# Altium schematic sheet Esquematico.SchDoc: Circuito Controlador LEDS
size A3; Date: 25/05/2023; CheckedBy: GAV; Author: MAG; Address1: MAG; Address2: GAV; Revision: 1; SheetNumber: 1; SheetTotal: 1
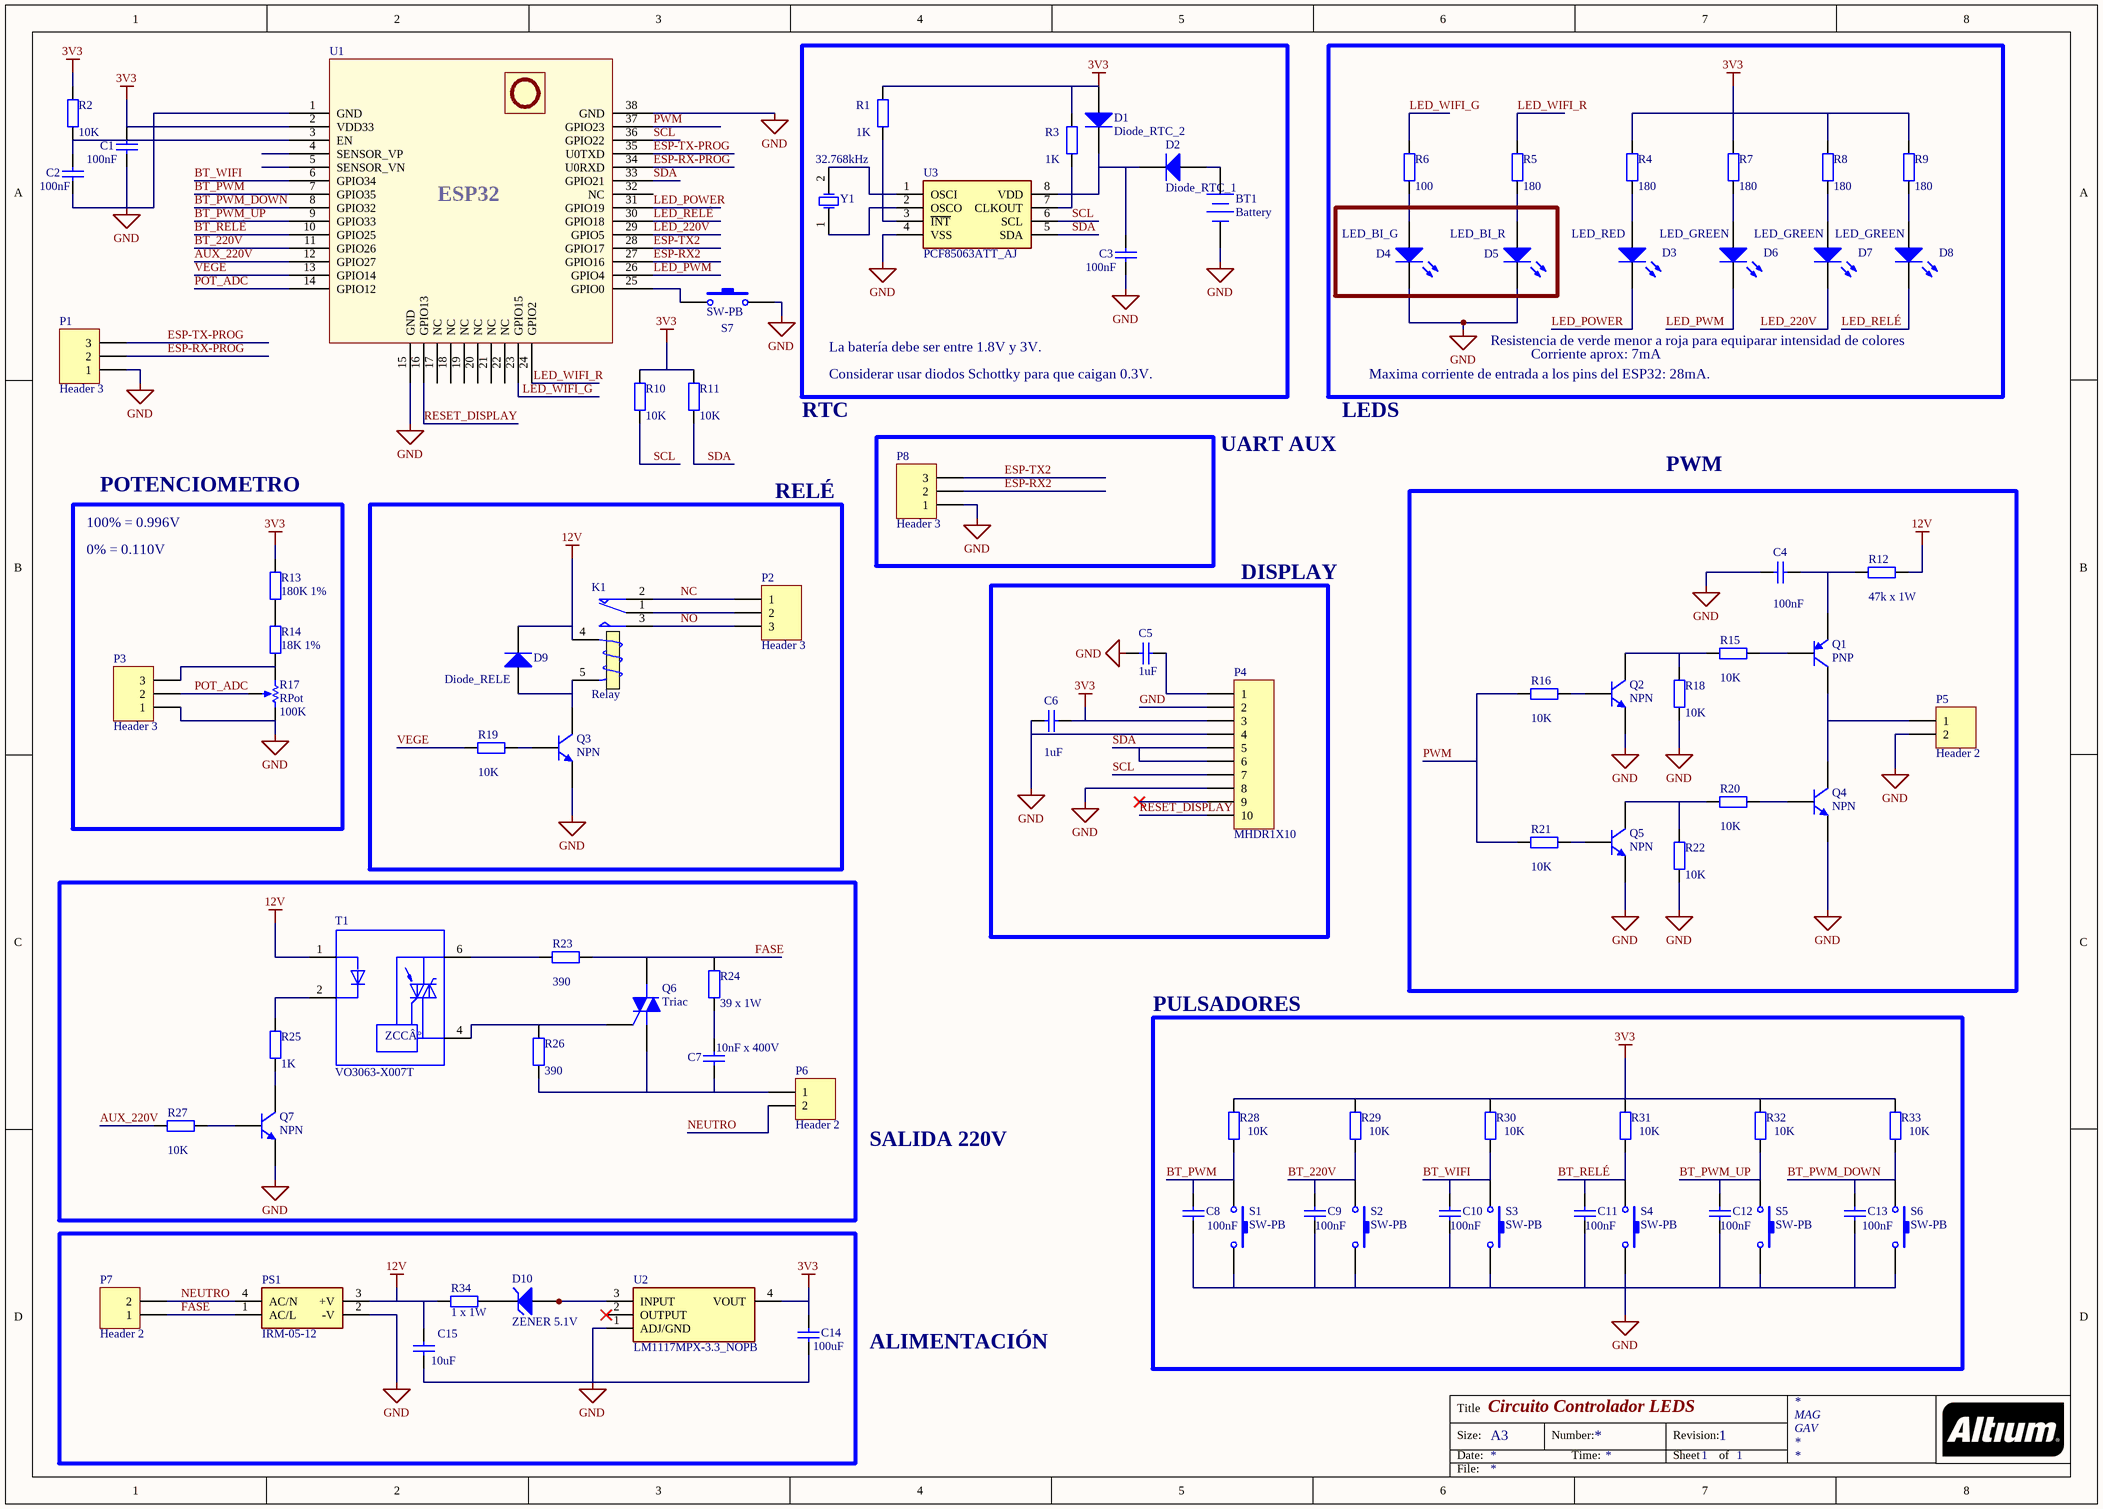
[diagram p0: Esquematico.SchDoc]

## Parts
BT1  Battery  [BAT-2]
C1  value 100nF  [RAD-0.3]  (hidden comment: Capacitor 100nF)
C2  value 100nF  [RAD-0.3]  (hidden comment: Capacitor 100nF)
C3  value 100nF  [RAD-0.3]  (hidden comment: Capacitor 100nF)
C4  value 100nF  [RAD-0.3]  (hidden comment: Capacitor 100nF)
C5  value 1uF  [RAD-0.3]  (hidden comment: Capacitor 1uF)
C6  value 1uF  [RAD-0.3]  (hidden comment: Capacitor 1uF)
C7  value 10nF x 400V  [RAD-0.3]  (hidden comment: Capacitor 10nF)
C8  value 100nF  [RAD-0.3]  (hidden comment: Capacitor 100nF)
C9  value 100nF  [RAD-0.3]  (hidden comment: Capacitor 100nF)
C10  value 100nF  [RAD-0.3]  (hidden comment: Capacitor 100nF)
C11  value 100nF  [RAD-0.3]  (hidden comment: Capacitor 100nF)
C12  value 100nF  [RAD-0.3]  (hidden comment: Capacitor 100nF)
C13  value 100nF  [RAD-0.3]  (hidden comment: Capacitor 100nF)
C14  value 100uF  [RAD-0.3]  (hidden comment: Capacitor 100uF)
C15  value 10uF  [RAD-0.3]  (hidden comment: Capacitor 10uF)
D1  Diode_RTC_2  [SMC]
D2  Diode_RTC_1  [SMC]
D3  LED_RED  [LED-0]
D4  LED_BI_G  [LED-0]
D5  LED_BI_R  [LED-0]
D6  LED_GREEN  [LED-0]
D7  LED_GREEN  [LED-0]
D8  LED_GREEN  [LED-0]
D9  Diode_RELE  [SMC]
D10  ZENER 5.1V  [DIODE-0.7]
K1  Relay  [MODULE5B]
P1  Header 3  [HDR1X3]
P2  Header 3  [HDR1X3]
P3  Header 3  [HDR1X3]
P4  MHDR1X10  [MHDR1X10]
P5  Header 2  [HDR1X2]
P6  Header 2  [HDR1X2]
P7  Header 2  [HDR1X2]
P8  Header 3  [HDR1X3]
PS1  IRM-05-12  [IRM0524]
Q1  PNP  [SOT-23B_L]
Q2  NPN  [TO-226-AA]
Q3  NPN  [TO-226-AA]
Q4  NPN  [TO-226-AA]
Q5  NPN  [TO-226-AA]
Q6  Triac  [369-03]
Q7  NPN  [TO-226-AA]
R1  value 1K  [AXIAL-0.4]  (hidden comment: Resistor 1k)
R2  value 10K  [AXIAL-0.4]  (hidden comment: Resistor 10k)
R3  value 1K  [AXIAL-0.4]  (hidden comment: Resistor 1k)
R4  value 180  [AXIAL-0.4]  (hidden comment: Resistor 100)
R5  value 180  [AXIAL-0.4]  (hidden comment: Resistor 50)
R6  value 100  [AXIAL-0.4]  (hidden comment: Resistor 100)
R7  value 180  [AXIAL-0.4]  (hidden comment: Resistor 100)
R8  value 180  [AXIAL-0.4]  (hidden comment: Resistor 100)
R9  value 180  [AXIAL-0.4]  (hidden comment: Resistor 100)
R10  value 10K  [AXIAL-0.4]  (hidden comment: Resistor 10k)
R11  value 10K  [AXIAL-0.4]  (hidden comment: Resistor 10k)
R12  value 47k x 1W  [AXIAL-0.4]  (hidden comment: Resistor 47k)
R13  value 180K 1%  [AXIAL-0.4]  (hidden comment: Resistor 180k)
R14  value 18K 1%  [AXIAL-0.4]  (hidden comment: Resistor 18k 1%)
R15  value 10K  [AXIAL-0.4]  (hidden comment: Resistor 10k)
R16  value 10K  [AXIAL-0.4]  (hidden comment: Resistor 10k)
R17  RPot  value 100K  [VR5]
R18  value 10K  [AXIAL-0.4]  (hidden comment: Resistor 10k)
R19  value 10K  [AXIAL-0.4]  (hidden comment: Resistor 10k)
R20  value 10K  [AXIAL-0.4]  (hidden comment: Resistor 10k)
R21  value 10K  [AXIAL-0.4]  (hidden comment: Resistor 10k)
R22  value 10K  [AXIAL-0.4]  (hidden comment: Resistor 10k)
R23  value 390  [AXIAL-0.4]  (hidden comment: Resistor 390)
R24  value 39 x 1W  [AXIAL-0.4]  (hidden comment: Resistor 39)
R25  value 1K  [AXIAL-0.4]  (hidden comment: Resistor 1k)
R26  value 390  [AXIAL-0.4]  (hidden comment: Resistor 390)
R27  value 10K  [AXIAL-0.4]  (hidden comment: Resistor 10k)
R28  value 10K  [AXIAL-0.4]  (hidden comment: Resistor 10k)
R29  value 10K  [AXIAL-0.4]  (hidden comment: Resistor 10k)
R30  value 10K  [AXIAL-0.4]  (hidden comment: Resistor 10k)
R31  value 10K  [AXIAL-0.4]  (hidden comment: Resistor 10k)
R32  value 10K  [AXIAL-0.4]  (hidden comment: Resistor 10k)
R33  value 10K  [AXIAL-0.4]  (hidden comment: Resistor 10k)
R34  value 1 x 1W  [AXIAL-0.4]  (hidden comment: Resistor 1)
S1  SW-PB  [SPST-2]
S2  SW-PB  [SPST-2]
S3  SW-PB  [SPST-2]
S4  SW-PB  [SPST-2]
S5  SW-PB  [SPST-2]
S6  SW-PB  [SPST-2]
S7  SW-PB  [SPST-2]
T1  VO3063-X007T  [SOIC254P1030X460-6N]
U1  ESP32-WROOM-UE32  (value not drawn)
U2  LM1117MPX-3.3_NOPB  [SOT230P700X180-4N]
U3  PCF85063ATT_AJ  [SOP65P490X110-8N]
Y1  32.768kHz  [R38]

## Blocks framed on the sheet
PWM: C4 P5 Q1 Q2 Q4 Q5 R12 R15 R16 R18 R20-R22
POTENCIOMETRO: P3 R13 R14 R17
RELÉ: D9 K1 P2 Q3 R19
DISPLAY: C5 C6 P4
PULSADORES: C8-C13 R28-R33 S1-S6

## Nets
3V3: C1.2 C6.1 C14.2 D1.1(A) P4.3 R1.2 R2.1 R3.2 R4.2 R7.2 R8.2 R9.2 R10.1 R11.1 R13.1 R28.2 R29.2 R30.2 R31.2 R32.2 R33.2 U1.2(VDD33) U2.4(VOUT)
12V: C15.2 D9.2(K) K1.4(T1) PS1.3(+V) R12.2 R34.1 T1.1(A)
GND: BT1.2(-) C1.1 C2.1 C3.1 C4.1 C5.2 C6.2 C8.1 C9.1 C10.1 C11.1 C12.1 C13.1 C14.1 C15.1 D4.2(K) D5.2(K) P1.1 P3.1 P4.2 P4.4 P4.8 P5.2 P8.1 PS1.2(-V) Q2.3(E) Q3.3(E) Q4.3(E) Q5.3(E) Q7.3(E) R17.2(BOT) R18.1 R22.1 S1.2 S2.2 S3.2 S4.2 S5.2 S6.2 S7.2 U1.1(GND) U1.15(GND) U1.38(GND) U2.1(ADJ/GND) U3.4(VSS)
AUX_220V: R27.2 U1.12(GPIO27)
BT_220V: C9.2 R29.1 S2.1 U1.11(GPIO26)
BT_PWM: C8.2 R28.1 S1.1 U1.7(GPIO35)
BT_PWM_DOWN: C13.2 R33.1 S6.1 U1.8(GPIO32)
BT_PWM_UP: C12.2 R32.1 S5.1 U1.9(GPIO33)
BT_RELÉ: C11.2 R31.1 S4.1 U1.10(GPIO25)
BT_WIFI: C10.2 R30.1 S3.1 U1.6(GPIO34)
ESP-RX2: P8.2 U1.27(GPIO16)
ESP-RX-PROG: P1.2 U1.34(U0RXD)
ESP-TX2: P8.3 U1.28(GPIO17)
ESP-TX-PROG: P1.3 U1.35(U0TXD)
FASE: P7.1 PS1.1(AC/L) Q6.2(M2) R23.1 R24.2
LED_220V: D7.2(K) U1.29(GPIO5)
LED_POWER: D3.2(K) U1.31(GPIO19)
LED_PWM: D6.2(K) U1.26(GPIO4)
LED_RELÉ: D8.2(K) U1.30(GPIO18)
LED_WIFI_G: R6.2 U1.23(GPIO15)
LED_WIFI_R: R5.2 U1.24(GPIO2)
NC: K1.2(NC) P2.1
NEUTRO: P6.2 P7.2 PS1.4(AC/N)
NO: K1.3(NO) P2.3
POT_ADC: P3.2 R17.3(TAP) U1.14(GPIO12)
PWM: R16.1 R21.1 U1.37(GPIO23)
RESET_DISPLAY: P4.10 U1.16(GPIO13)
SCL: P4.7 R10.2 U1.36(GPIO22) U3.6(SCL)
SDA: P4.5 P4.6 R11.2 U1.33(GPIO21) U3.5(SDA)
VEGE: R19.2 U1.13(GPIO14)
NetBT1_1: BT1.1(+) D2.1(A)
NetC2_2: C2.2 R2.2 U1.3(EN)
NetC3_2: C3.2 D1.2(K) D2.2(K) U3.8(VDD)
NetC4_2: C4.2 Q1.3(E) R12.1
NetC5_1: C5.1 P4.1
NetC7_1: C7.1 P6.1 Q6.1(M1) R26.2
NetC7_2: C7.2 R24.1
NetD3_1: D3.1(A) R4.1
NetD4_1: D4.1(A) R6.1
NetD5_1: D5.1(A) R5.1
NetD6_1: D6.1(A) R7.1
NetD7_1: D7.1(A) R8.1
NetD8_1: D8.1(A) R9.1
NetD9_1: D9.1(A) K1.5(T2) Q3.1(C)
NetD10_1: D10.1(A) U2.3(INPUT)
NetD10_2: D10.2(K) R34.2
NetK1_1: K1.1(COM) P2.2
NetP3_3: P3.3 R14.2 R17.1(TOP)
NetP5_1: P5.1 Q1.1(C) Q4.1(C)
NetQ1_2: Q1.2(B) R15.2
NetQ2_1: Q2.1(C) R15.1 R18.2
NetQ2_2: Q2.2(B) R16.2
NetQ3_2: Q3.2(B) R19.1
NetQ4_2: Q4.2(B) R20.2
NetQ5_1: Q5.1(C) R20.1 R22.2
NetQ5_2: Q5.2(B) R21.2
NetQ6_3: Q6.3(G) R26.1 T1.4(MT1)
NetQ7_1: Q7.1(C) R25.1
NetQ7_2: Q7.2(B) R27.1
NetR1_1: R1.1 U3.3(~{INT})
NetR3_1: R3.1 U3.7(CLKOUT)
NetR13_2: R13.2 R14.1
NetR23_2: R23.2 T1.6(MT2)
NetR25_2: R25.2 T1.2(C)
NetS7_1: S7.1 U1.25(GPIO0)
NetU3_1: U3.1(OSCI) Y1.2(OSC2)
NetU3_2: U3.2(OSCO) Y1.1(OSC1)

Not connected (* = marked no-connect by the designer): P4 9*; U1 4(SENSOR_VP) 5(SENSOR_VN) 17(NC) 18(NC) 19(NC) 20(NC) 21(NC) 22(NC) 32(NC); U2 2(OUTPUT)*

## Notes on the sheet
- (near U1) ESP32
- La batería debe ser entre 1.8V y 3V.
- Considerar usar diodos Schottky para que caigan 0.3V.
- Maxima corriente de entrada a los pins del ESP32: 28mA.
- Resistencia de verde menor a roja para equiparar intensidad de colores
- Corriente aprox: 7mA
- RTC
- UART AUX
- LEDS
- 100% = 0.996V
- 0% = 0.110V
- SALIDA 220V
- ALIMENTACIÓN
- Title
- Size:
- Date:
- A3
- Number:
- Time:
- Revision:
- Sheet
- of
- File:
- (in symbol VO3063-X007T) ZCCÂ°

## Library data of the parts
BT1 = Battery: Multicell Battery; Published: 24-Mar-1999; LatestRevisionDate: 17-Jul-2002; LatestRevisionNote: Re-released for DXP Platform.; PackageReference: BAT-2; Publisher: Altium Limited; PackageDescription: Battery; 2 Leads
C1-C15 = Cap: Capacitor; Published: 8-Jun-2000; LatestRevisionDate: 17-Jul-2002; LatestRevisionNote: Re-released for DXP Platform.; PackageReference: RAD-0.3; Publisher: Altium Limited; PackageDescription: Radial Cap, Thru-Hole; 2 Leads; 0.3 in Pin Spacing
D1 D2 D9 = Diode: Default Diode; Published: 8-Jun-2000; LatestRevisionDate: 17-Jul-2002; LatestRevisionNote: Re-released for DXP Platform.; PackageVersion: Sep-1996; PackageReference: SMC; Publisher: Altium Limited; PackageDescription: DO-214-AB/SMC; 2 C-Bend Leads; Body 7.9 x 5.9 mm, inc. leads (LxW); Code_JEDEC: DO-214-AB
D3-D8 = LED0: Typical INFRARED GaAs LED; Published: 8-Jun-2000; LatestRevisionDate: 08-Jul-2005; LatestRevisionNote: Mech Layer 1 removed.; PackageReference: LED-0; Publisher: Altium Limited; PackageDescription: LED; 2 Leads
D10 = D Zener: Zener Diode; Published: 8-Jun-2000; LatestRevisionDate: 17-Jul-2002; LatestRevisionNote: Re-released for DXP Platform.; PackageReference: DIODE-0.7; Publisher: Altium Limited; PackageDescription: Diode, Thru-Hole; 2 Leads; 0.7 in Pin Spacing
K1 = Relay: SPDT Relay; Published: 8-Jun-2000; LatestRevisionDate: 17-Jul-2002; LatestRevisionNote: Re-released for DXP Platform.; PackageReference: MODULE5B; Publisher: Altium Limited
P1-P3 P8 = Header 3: Header, 3-Pin; LatestRevisionDate: 17-Jul-2002; LatestRevisionNote: Re-released for DXP Platform.; Publisher: Altium Limited
P4 = MHDR1X10: Header, 10-Pin; LatestRevisionDate: 17-Jul-2002; LatestRevisionNote: Re-released for DXP Platform.; Publisher: Altium Limited
P5-P7 = Header 2: Header, 2-Pin; LatestRevisionDate: 17-Jul-2002; LatestRevisionNote: Re-released for DXP Platform.; Publisher: Altium Limited
PS1 = IRM-05-24: Power Supply; Manufacturer_Name: Mean Well; Datasheet Link: https://www.farnell.com/datasheets/2547884.pdf; Height: 21.5mm; Manufacturer_Part_Number: IRM-05-24; Mouser Part Number: 709-IRM05-24; Mouser Price/Stock: https://www.mouser.co.uk/ProductDetail/MEAN-WELL/IRM-05-24?qs=WkdRfq4wf1PSjoBZExbP%252Bg%3D%3D; Arrow Part Number: IRM-05-24; Arrow Price/Stock: https://www.arrow.com/en/products/irm-05-24/mean-well-enterprises?region=nac
Q1 = PNP: PNP Bipolar Transistor; Published: 8-Jun-2000; LatestRevisionDate: 29-May-2009; LatestRevisionNote: IPC-7351 Footprint Added.; PackageVersion: Aug-1999; PackageReference: SOT-23B; Publisher: Altium Limited; PackageDescription: 3-Pin SOT-23 Package 0.95 mm Pitch, 2.4 mm Lead Span
Q2-Q5 Q7 = NPN: NPN Bipolar Transistor; Published: 8-Jun-2000; LatestRevisionDate: 17-Jul-2002; LatestRevisionNote: Re-released for DXP Platform.; PackageReference: TO-226-AA; Publisher: Altium Limited; PackageDescription: TO, Flat Index; 3 In-Line, Axial Leads; Body Dia. 4.8mm; Leads 0.55 x 0.51 mm (max); Code_JEDEC: TO-226-AA
Q6 = Triac: Silicon Bidirectional Triode Thyristor; Note: Pin 2 is electrically connected to Pin 4 (TAB); Published: 29-Sep-2000; LatestRevisionDate: 17-Jul-2002; LatestRevisionNote: Re-released for DXP Platform.; DatasheetVersion: 1999; PackageReference: 369-03; Publisher: Altium Limited; PackageDescription: TO, Thru-Hole, Vertical, Heatsink Mounted; 3 In-Line Leads; Pitch 2.28 mm; ComponentLink1Description: Manufacturer Link; ComponentLink1URL: http://www.motorola.com/
R1-R16 R18-R34 = Res2: Resistor; Published: 8-Jun-2000; LatestRevisionDate: 17-Jul-2002; LatestRevisionNote: Re-released for DXP Platform.; PackageReference: AXIAL-0.4; Publisher: Altium Limited; PackageDescription: Axial Device, Thru-Hole; 2 Leads; 0.4 in Pin Spacing
R17 = RPot: Potentiometer; Sim Note: Enter the Resistance value and the set point into parameter fields.; Set Position: 0.5; Published: 8-Jun-2000; LatestRevisionDate: 17-Jul-2002; LatestRevisionNote: Re-released for DXP Platform.; PackageReference: VR5; Publisher: Altium Limited; PackageDescription: Variable Resistor, Thru-Hole; 3 Leads
S1-S7 = SW-PB: Switch; Published: 24-Mar-1999; LatestRevisionDate: 17-Jul-2002; LatestRevisionNote: Re-released for DXP Platform.; PackageReference: SPST-2; Publisher: Altium Limited; PackageDescription: Switch; 2 Leads
T1 = VO3063-X007T: Phototriac, Zero Crossing, 1.5 kV/Î¼s dV/dt, 600 V; Package: None; Price: None; Value: *; MP: VO3063-X007T; Availability: Unavailable
U1 = Component_1
U2 = LM1117MPX-3.3_NOPB: Integrated Circuit; Manufacturer_Name: Texas Instruments; Manufacturer_Part_Number: LM1117MPX-3.3/NOPB; Datasheet Link: http://www.ti.com/lit/ds/symlink/lm1117.pdf; Height: 1.8mm; Mouser Part Number: 926-LM1117MPX3.3NOPB; Mouser Price/Stock: https://www.mouser.co.uk/ProductDetail/Texas-Instruments/LM1117MPX-3.3-NOPB?qs=X1J7HmVL2ZHRbBIxXi4utg%3D%3D; Arrow Part Number: LM1117MPX-3.3/NOPB; Arrow Price/Stock: https://www.arrow.com/en/products/lm1117mpx-3.3nopb/texas-instruments?region=nac
U3 = PCF85063ATT_AJ: Integrated Circuit; Manufacturer_Name: NXP; Manufacturer_Part_Number: PCF85063ATT/AJ; Datasheet Link: http://www.nxp.com/docs/en/data-sheet/PCF85063A.pdf; Height: 1.1mm; Mouser Part Number: 771-PCF85063ATT/AJ; Mouser Price/Stock: https://www.mouser.co.uk/ProductDetail/NXP-Semiconductors/PCF85063ATT-AJ?qs=%252BRKXB2WKlSdUg9yANFWVzw%3D%3D; Arrow Part Number: PCF85063ATT/AJ; Arrow Price/Stock: https://www.arrow.com/en/products/pcf85063attaj/nxp-semiconductors?region=nac
Y1 = XTAL: Crystal Oscillator; Published: 8-Jun-2000; LatestRevisionDate: 17-Jul-2002; LatestRevisionNote: Re-released for DXP Platform.; PackageReference: R38; Publisher: Altium Limited; PackageDescription: Crystal, Thru-Hole; 2 Leads; Body 3.1 x 8.2 mm (Dia.xH)